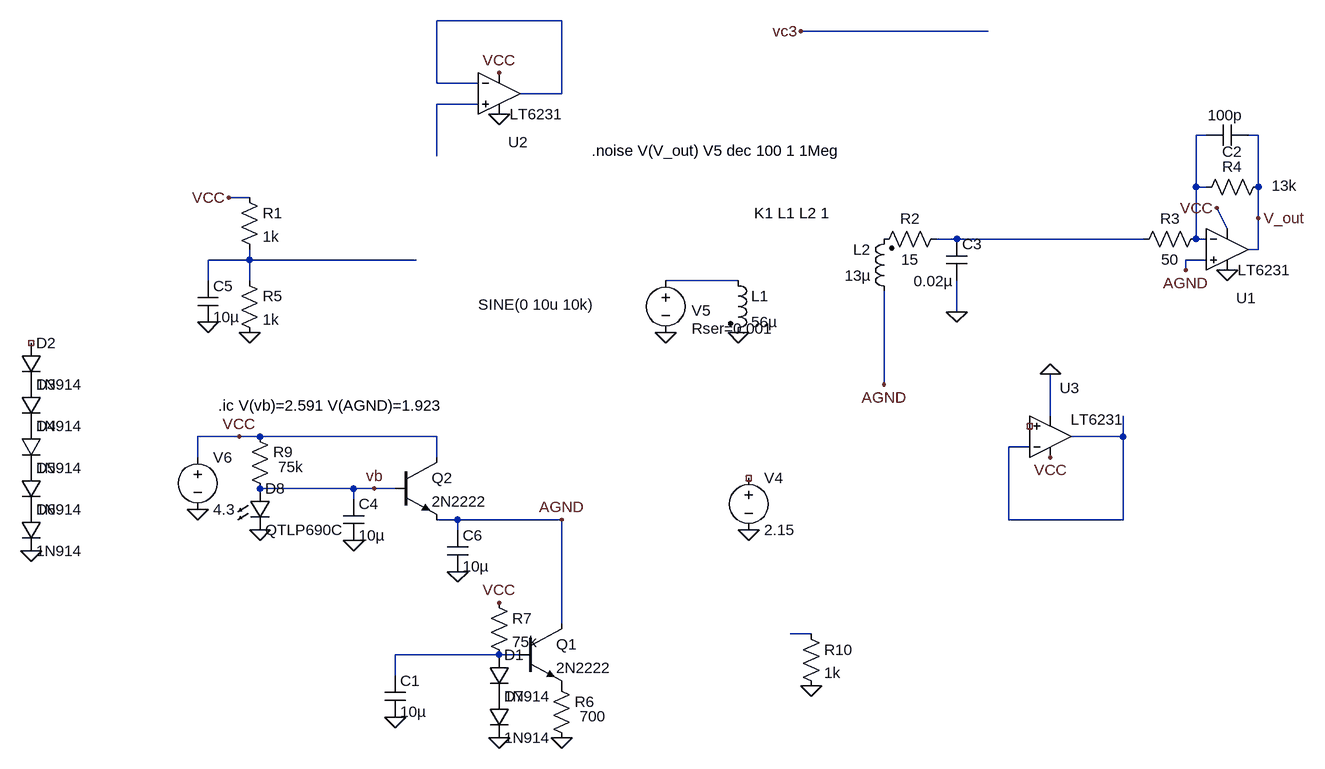
[diagram p0: schematic Noise_SDR_IQ.asc]
Noise_SDR_IQ.asc, the LTspice schematic file:
Version 4
SHEET 1 880 680
WIRE -496 -656 -688 -656
WIRE 160 -640 -128 -640
WIRE -688 -560 -688 -656
WIRE -624 -560 -688 -560
WIRE -496 -544 -496 -656
WIRE -496 -544 -560 -544
WIRE -624 -528 -688 -528
WIRE 496 -480 480 -480
WIRE 576 -480 560 -480
WIRE -688 -448 -688 -528
WIRE 480 -400 480 -480
WIRE 496 -400 480 -400
WIRE 576 -400 576 -480
WIRE -976 -384 -1008 -384
WIRE 576 -352 576 -400
WIRE 528 -336 512 -368
WIRE 112 -320 80 -320
WIRE 400 -320 112 -320
WIRE 480 -320 480 -400
WIRE 496 -320 480 -320
WIRE 576 -304 576 -352
WIRE 576 -304 560 -304
WIRE -976 -288 -976 -304
WIRE -976 -288 -1040 -288
WIRE -720 -288 -976 -288
WIRE 496 -288 464 -288
WIRE 464 -272 464 -288
WIRE -1040 -256 -1040 -288
WIRE -976 -256 -976 -288
WIRE -224 -256 -336 -256
WIRE 112 -208 112 -256
WIRE 0 -96 0 -240
WIRE 256 -48 256 -112
WIRE -992 -16 -1056 -16
WIRE -960 -16 -992 -16
WIRE -688 -16 -960 -16
WIRE 368 -16 368 -48
WIRE 368 -16 288 -16
WIRE 224 0 192 0
WIRE -1056 16 -1056 -16
WIRE -688 16 -688 -16
WIRE -816 64 -960 64
WIRE -784 64 -816 64
WIRE -752 64 -784 64
WIRE -816 80 -816 64
WIRE -656 112 -688 112
WIRE -496 112 -656 112
WIRE 192 112 192 0
WIRE 368 112 368 -16
WIRE 368 112 192 112
WIRE -656 128 -656 112
WIRE -496 272 -496 112
WIRE -112 288 -144 288
WIRE -592 320 -752 320
WIRE -560 320 -592 320
WIRE -752 352 -752 320
FLAG 464 -272 AGND
FLAG 512 -368 VCC
FLAG 528 -272 0
FLAG 112 -208 0
FLAG 576 -352 V_out
FLAG -976 -176 0
FLAG -1040 -192 0
FLAG -1008 -384 VCC
FLAG -592 -512 0
FLAG -592 -576 VCC
FLAG -336 -176 0
FLAG 256 16 VCC
FLAG -1056 96 0
FLAG -1312 160 0
FLAG -816 144 0
FLAG -496 112 AGND
FLAG -992 -16 VCC
FLAG -112 368 0
FLAG -656 192 0
FLAG -784 64 vb
FLAG -208 128 0
FLAG -224 -176 0
FLAG 0 -96 AGND
FLAG -592 448 0
FLAG -496 448 0
FLAG -592 240 VCC
FLAG -752 416 0
FLAG -128 -640 vc3
FLAG 256 -112 0
FLAG -960 128 0
SYMBOL Opamps\\LT6231 528 -304 R0
WINDOW 0 14 75 Left 2
SYMATTR InstName U1
SYMBOL res 496 -336 R90
WINDOW 0 0 56 VBottom 2
WINDOW 3 32 56 VTop 2
SYMATTR InstName R3
SYMATTR Value 50
SYMBOL res 592 -416 R90
WINDOW 0 0 56 VBottom 2
WINDOW 3 -2 -24 VTop 2
SYMATTR InstName R4
SYMATTR Value 13k
SYMBOL cap 560 -496 R90
WINDOW 0 57 24 VBottom 2
WINDOW 3 -30 35 VTop 2
SYMATTR InstName C2
SYMATTR Value 100p
SYMBOL cap 96 -320 R0
WINDOW 3 -50 65 Left 2
SYMATTR Value 0.02µ
SYMATTR InstName C3
SYMBOL res -992 -400 R0
SYMATTR InstName R1
SYMATTR Value 1k
SYMBOL res -992 -272 R0
SYMATTR InstName R5
SYMATTR Value 1k
SYMBOL cap -1056 -256 R0
SYMATTR InstName C5
SYMATTR Value 10µ
SYMBOL Opamps\\LT6231 -592 -544 R0
WINDOW 0 14 75 Left 2
SYMATTR InstName U2
SYMBOL voltage -336 -272 R0
WINDOW 0 40 62 Left 2
WINDOW 3 -288 53 Left 2
WINDOW 123 0 0 Left 0
WINDOW 39 40 90 Left 2
SYMATTR InstName V5
SYMATTR Value SINE(0 10u 10k)
SYMATTR SpiceLine Rser=0.001
SYMBOL Opamps\\LT6231 256 -16 M180
WINDOW 0 14 75 Left 2
WINDOW 3 31 26 Left 2
SYMATTR InstName U3
SYMBOL res -976 -32 R0
WINDOW 3 44 63 Left 2
SYMATTR Value 75k
SYMATTR InstName R9
SYMBOL cap -832 80 R0
SYMATTR InstName C4
SYMATTR Value 10µ
SYMBOL voltage -1056 0 R0
WINDOW 123 0 0 Left 0
WINDOW 39 0 0 Left 0
SYMATTR InstName V6
SYMATTR Value 4.3
SYMBOL npn -752 16 R0
SYMATTR InstName Q2
SYMATTR Value 2N2222
SYMBOL res -128 272 R0
SYMATTR InstName R10
SYMATTR Value 1k
SYMBOL cap -672 128 R0
SYMATTR InstName C6
SYMATTR Value 10µ
SYMBOL diode -1328 -160 R0
SYMATTR InstName D2
SYMATTR Value 1N914
SYMBOL diode -1328 -96 R0
SYMATTR InstName D3
SYMATTR Value 1N914
SYMBOL diode -1328 -32 R0
SYMATTR InstName D4
SYMATTR Value 1N914
SYMBOL diode -1328 32 R0
SYMATTR InstName D5
SYMATTR Value 1N914
SYMBOL diode -1328 96 R0
SYMATTR InstName D6
SYMATTR Value 1N914
SYMBOL voltage -208 32 R0
WINDOW 123 0 0 Left 0
WINDOW 39 0 0 Left 0
SYMATTR InstName V4
SYMATTR Value 2.15
SYMBOL res 96 -336 R90
WINDOW 0 0 56 VBottom 2
WINDOW 3 32 56 VTop 2
SYMATTR InstName R2
SYMATTR Value 15
SYMBOL ind2 -240 -272 R0
SYMATTR InstName L1
SYMATTR Value 56µ
SYMATTR Type ind
SYMBOL ind2 16 -224 R180
WINDOW 0 36 80 Left 2
WINDOW 3 36 40 Left 2
SYMATTR InstName L2
SYMATTR Value 13µ
SYMATTR Type ind
SYMBOL npn -560 272 R0
SYMATTR InstName Q1
SYMATTR Value 2N2222
SYMBOL res -512 352 R0
WINDOW 3 44 63 Left 2
SYMATTR Value 700
SYMATTR InstName R6
SYMBOL res -608 224 R0
SYMATTR InstName R7
SYMATTR Value 75k
SYMBOL diode -608 320 R0
SYMATTR InstName D1
SYMATTR Value 1N914
SYMBOL diode -608 384 R0
SYMATTR InstName D7
SYMATTR Value 1N914
SYMBOL cap -768 352 R0
SYMATTR InstName C1
SYMATTR Value 10µ
SYMBOL LED -976 64 R0
SYMATTR InstName D8
SYMATTR Value QTLP690C
TEXT -1024 -64 Left 2 !.ic V(vb)=2.591 V(AGND)=1.923
TEXT -450 -456 Left 2 !.noise V(V_out) V5 dec 100 1 1Meg
TEXT -200 -360 Left 2 !K1 L1 L2 1

The netlist it stands for:
* Noise_SDR_IQ.asc
XU1 AGND N003 V_out VCC 0 LT6231  ; pins In+ In- OUT V+ V-
R3 N003 N004 50
R4 V_out N003 13k
C2 V_out N003 100p
C3 N004 0 0.02µ
R1 VCC N005 1k
R5 N005 0 1k
C5 N005 0 10µ
XU2 N002 N001 N001 VCC 0 LT6231  ; pins In+ In- OUT V+ V-
V5 N006 0 SINE(0 10u 10k) Rser=0.001
XU3 NC_01 N007 N007 VCC 0 LT6231  ; pins In+ In- OUT V+ V-
R9 VCC vb 75k
C4 vb 0 10µ
V6 VCC 0 4.3
Q2 VCC vb AGND 0 2N2222
R10 N008 0 1k
C6 AGND 0 10µ
D2 NC_02 P001 1N914
D3 P001 P002 1N914
D4 P002 P003 1N914
D5 P003 P004 1N914
D6 P004 0 1N914
V4 NC_03 0 2.15
R2 N004 P005 15
L1 N006 0 56µ
L2 AGND P005 13µ
Q1 AGND N009 P006 0 2N2222
R6 P006 0 700
R7 VCC N009 75k
D1 N009 P007 1N914
D7 P007 0 1N914
C1 N009 0 10µ
D8 vb 0 QTLP690C
.model D D
.lib standard.dio
.model NPN NPN
.model PNP PNP
.lib standard.bjt
.ic V(vb)=2.591 V(AGND)=1.923
.noise V(V_out) V5 dec 100 1 1Meg
K1 L1 L2 1
.lib LTC2.lib
.backanno
.end